# Altium schematic sheet PDM-S01-V00-PDMCConnector.SchDoc: PDMC Connector
size A3; DrawnBy: Zoe Goodward; Organization: QUT Motorsport; Address1: O-120, Gardens Point; Address2: 2 George Street; Address3: Brisbane, QLD 4000; Address4: Australia; DocumentNumber: ####; Revision: 01; SheetNumber: 1; SheetTotal: 1; Version: 01; Project: Power Distribution Module 2020; PageSetup: Record=PageOptions|CenterHorizontal=True|CenterVertical=True|PrintScale=0.97|XCorrection=1.00|YCorrection=1.00|PrintKind=0|BorderSize=5000000|LeftOffset=0|BottomOffset=0|Orientation=2|PaperLength=1000|PaperWidth=1000|Scale=100|PaperSource=7|PrintQuality=-4|MediaType=1|DitherType=10|PaperKind=A4|PrintScaleMode=1
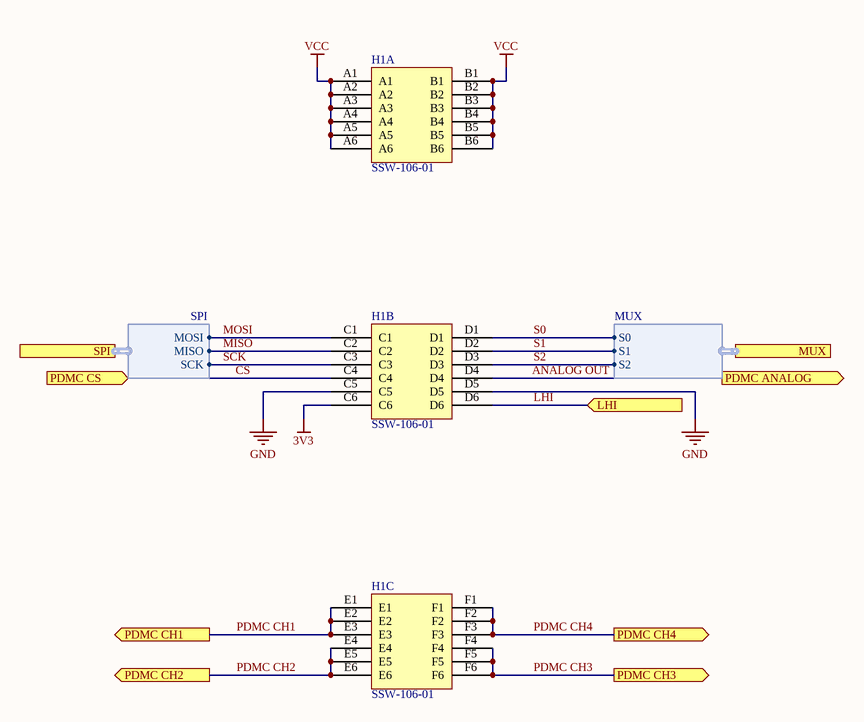
[diagram p0: PDM-S01-V00-PDMCConnector.SchDoc]

## Parts
H1  SSW-106-01  [SSW-106-01]  (parts A,B,C of 3)

## Ports
LHI (in), MUX (harness MUX), PDMC ANALOG (out), PDMC CH1 (out), PDMC CH2 (out), PDMC CH3 (out), PDMC CH4 (out), PDMC CS (in), SPI (harness SPI)

## Harnesses
MUX: S0, S1, S2
SPI: MOSI, MISO, SCK

## Nets
3V3: H1.C6
GND: H1.C5 H1.D5
VCC: H1.A1 H1.A2 H1.A3 H1.A4 H1.A5 H1.A6 H1.B1 H1.B2 H1.B3 H1.B4 H1.B5 H1.B6
ANALOG OUT: H1.D4 ; port PDMC ANALOG
CS: H1.C4 ; port PDMC CS
LHI: H1.D6 ; port LHI
MISO: H1.C2 ; port SPI.MISO
MOSI: H1.C1 ; port SPI.MOSI
PDMC CH1: H1.E1 H1.E2 H1.E3 ; port PDMC CH1
PDMC CH2: H1.E4 H1.E5 H1.E6 ; port PDMC CH2
PDMC CH3: H1.F4 H1.F5 H1.F6 ; port PDMC CH3
PDMC CH4: H1.F1 H1.F2 H1.F3 ; port PDMC CH4
S0: H1.D1 ; port MUX.S0
S1: H1.D2 ; port MUX.S1
S2: H1.D3 ; port MUX.S2
SCK: H1.C3 ; port SPI.SCK

## Notes on the sheet
- Revision History:
- Sheet Title:
- Rev
- Date
- Description
- Project:
- Size:
- Drawn By:
- A3
- Number:
- Revision:
- Sheet
- Version:
- of
- QUT Motorsport
- O-120, Gardens Point
- 2 George Street
- Brisbane, QLD 4000
- Australia
- Print Date:
- Print Time:
- File Name:

## Library data of the parts
H1 = SSW-106-01: CONN RCPT 12POS 0.1 TIN PCB; ComponentLink1Description: Datasheet; ComponentLink1URL: http://suddendocs.samtec.com/catalog_english/ssw_th.pdf; ComponentLink2Description: Digikey; ComponentLink2URL: https://www.digikey.com.au/product-detail/en/samtec-inc/SSW-106-01-T-D/SAM1212-06-ND/1112250